# EAGLE schematic breakout-lrtb-g6tg_full (EAGLE 6.5.0)
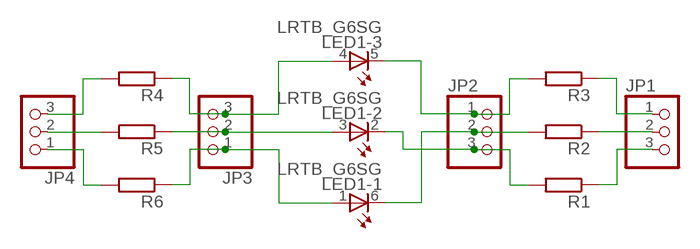
[diagram p0: schematic, sheet 1]

## Parts
JP1  PINHD-1X3  [1X03]
JP2  PINHD-1X3  [1X03]
JP3  PINHD-1X3  [1X03]
JP4  PINHD-1X3  [1X03]
LED1  LRTB_G6SG  [LRTB_G6SG]
R1  R-EU_R0805  [R0805]
R2  R-EU_R0805  [R0805]
R3  R-EU_R0805  [R0805]
R4  R-EU_R0805  [R0805]
R5  R-EU_R0805  [R0805]
R6  R-EU_R0805  [R0805]

## Nets
N$1: JP4.3 R4.2
N$2: JP4.2 R5.2
N$3: JP4.1 R6.2
N$4: JP3.2 LED1.3(-2:A) R5.1
N$5: JP3.3 LED1.4(-3:A) R4.1
N$6: JP3.1 LED1.1(-1:A) R6.1
N$7: JP2.2 LED1.6(-1:C) R2.2
N$8: JP2.1 LED1.5(-3:C) R3.2
N$9: JP2.3 LED1.2(-2:C) R1.2
N$10: JP1.2 R2.1
N$11: JP1.1 R3.1
N$12: JP1.3 R1.1

## Library data of the parts
JP1-JP4 = pinhead:PINHD-1X3: PIN HEADER
LED1 = led:LRTB_G6SG: LRTB G6SG 6-lead TOPLED® Source: OSRAM Opto Semiconductors ... LRTB_G6SG_Pb_free.pdf
R1-R6 = rcl:R-EU_: RESISTOR, European symbol